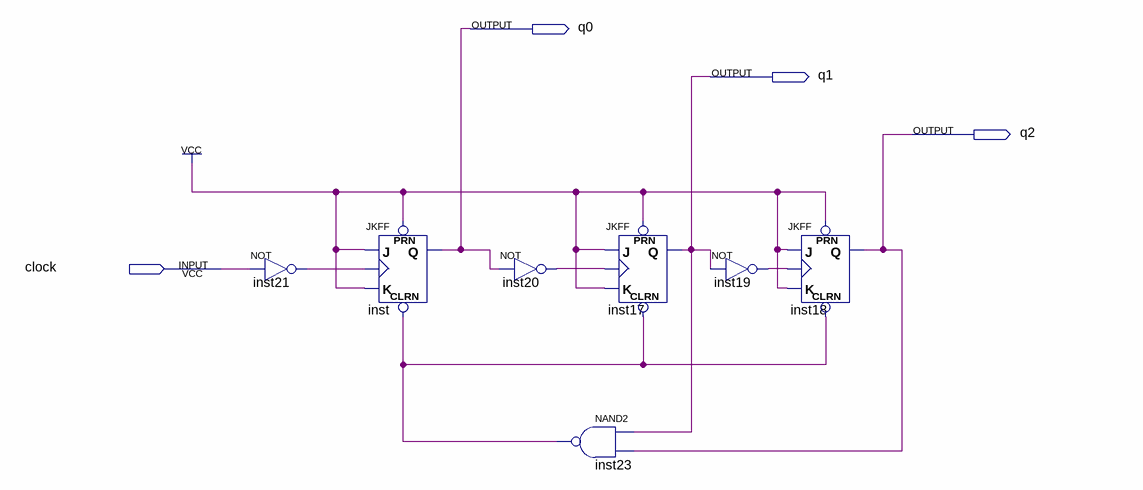
[diagram p0: schematic sheet]
// Quartus schematic a.bdf as structural Verilog: 7 symbols, 4 pins
module a (
  input  clock,
  output q0,
  output q1,
  output q2
);

  wire inst19_out, inst20_out, inst21_out, inst23_out;

  not inst21 (inst21_out, clock);
  JKFF inst (.PRN(1'b1), .CLRN(inst23_out), .K(1'b1), .J(1'b1), .CLK(inst21_out), .Q(q0));
  not inst20 (inst20_out, q0);
  JKFF inst17 (.PRN(1'b1), .CLRN(inst23_out), .K(1'b1), .J(1'b1), .CLK(inst20_out), .Q(q1));
  nand inst23 (inst23_out, q1, q2);
  not inst19 (inst19_out, q1);
  JKFF inst18 (.PRN(1'b1), .CLRN(inst23_out), .K(1'b1), .J(1'b1), .CLK(inst19_out), .Q(q2));
endmodule
